# EAGLE design main_pa8 (EAGLE 4.13)
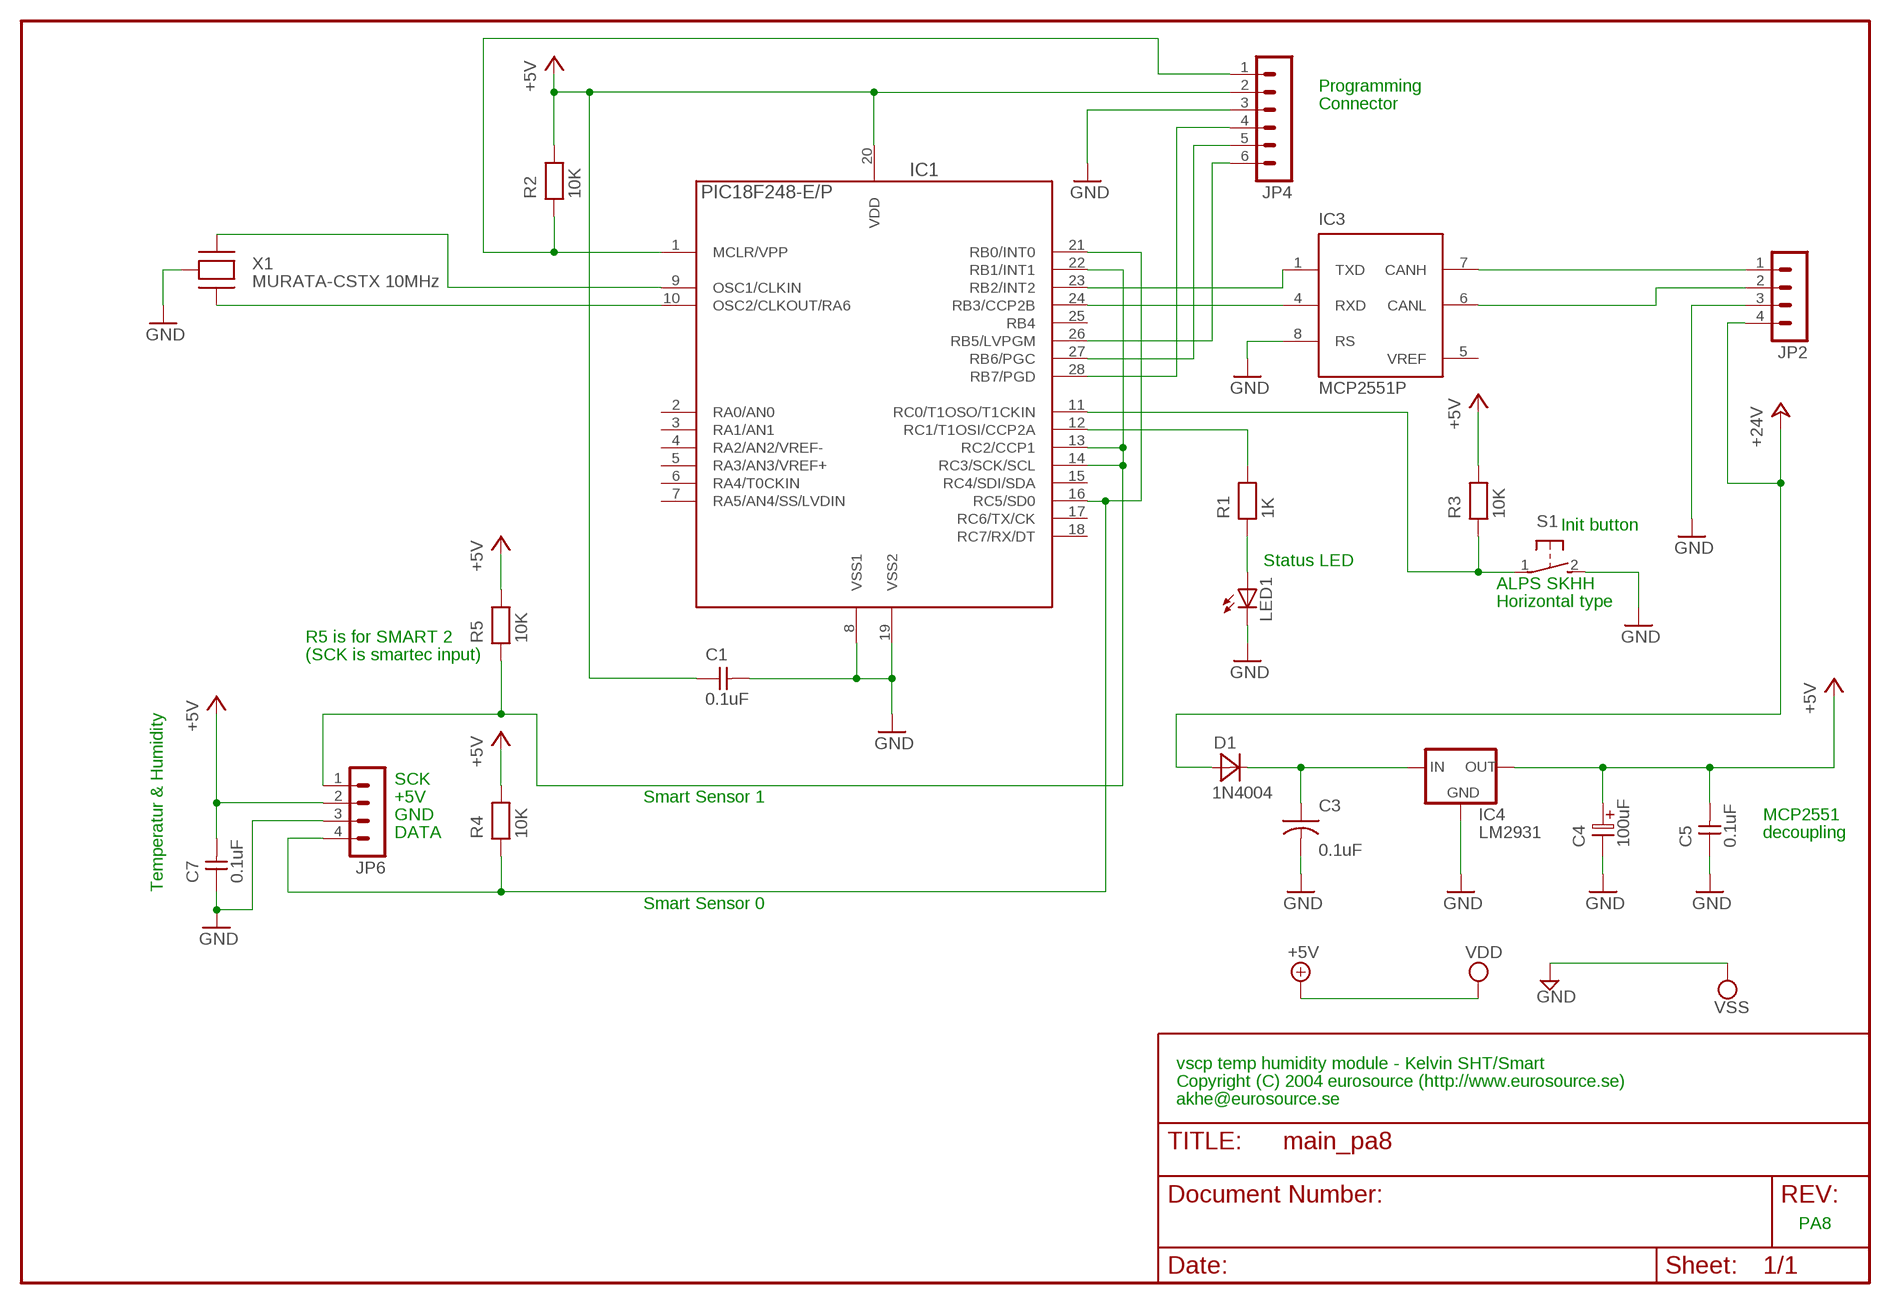
[diagram p0: schematic, sheet 1]

## Parts
C1  0.1uF  CAPNP-2,5  [C-2,5]
C3  0.1uF  CAP-5  [C-5]
C4  100uF  ELC-5  [ES-5]
C5  0.1uF  CAPNP-2,5  [C-2,5]
C7  0.1uF  CAPNP-2,5  [C-2,5]
D1  1N4004  DIODE-10  [D-10]
IC1  PIC18F248-E/P  PIC18F252-E/P  [PDIP-28]
IC3  MCP2551P  [DIL8]
IC4  LM2931  78LXX  [78LXX]
JP2  MA04-1  [MA04-1]
JP4  MA06-1  [MA06-1]
JP6  MA04-1  [MA04-1]
LED1  LED3MM  [LED3MM]
R1  1K  RESEU-10  [R-10]
R2  10K  RESEU-10  [R-10]
R3  10K  RESEU-10  [R-10]
R4  10K  RESEU-10  [R-10]
R5  10K  RESEU-10  [R-10]
S1  31-XX  [B3F-31XX]
X1  MURATA-CSTX 10MHz  MURATA-CSTX  [RESONATOR-MURATA]

## Nets
+5V: C1.1 C4.1 C5.2 C7.2 IC1.20(VDD) IC4.OUT JP4.2 JP6.2 R2.2 R3.2 R4.2 R5.2 ; supply symbol labelled VDD
+24V: D1.1(A) JP2.4
CANH: IC3.7(CANH) JP2.1
CANL: IC3.6(CANL) JP2.2
GND: C1.2 C3.2 C4.2 C5.1 C7.1 IC1.8(VSS1) IC1.19(VSS2) IC3.8(RS) IC4.GND JP2.3 JP4.3 JP6.3 LED1.K(C) S1.2(S) X1.2(GND) ; supply symbol labelled VSS
N$1: LED1.A R1.1
N$2: IC1.12(RC1/T1OSI/CCP2A) R1.2
N$3: IC1.10(OSC2/CLKOUT/RA6) X1.3(XTOUT)
N$4: IC1.1(MCLR/VPP) JP4.1 R2.1
N$5: IC1.28(RB7/PGD) JP4.4
N$6: IC1.11(RC0/T1OSO/T1CKIN) R3.1 S1.1(P)
N$7: IC1.27(RB6/PGC) JP4.5
N$8: IC1.26(RB5/LVPGM) JP4.6
N$11: C3.1 D1.2(K) IC4.IN
OSC1: IC1.9(OSC1/CLKIN) X1.1(XTIN)
RXCAN: IC1.24(RB3/CCP2B) IC3.4(RXD)
SCK: IC1.13(RC2/CCP1) IC1.14(RC3/SCK/SCL) IC1.22(RB1/INT1) JP6.1 R5.1
SDO: IC1.16(RC5/SD0) IC1.21(RB0/INT0) JP6.4 R4.1
TXCAN: IC1.23(RB2/INT2) IC3.1(TXD)
Unconnected: IC1.2(RA0/AN0) IC1.3(RA1/AN1) IC1.4(RA2/AN2/VREF-) IC1.5(RA3/AN3/VREF+) IC1.6(RA4/T0CKIN) IC1.7(RA5/AN4/SS/LVDIN) IC1.15(RC4/SDI/SDA) IC1.17(RC6/TX/CK) IC1.18(RC7/RX/DT) IC1.25(RB4)

## Notes on the sheet
- Programming
- Connector
- Init button
- Status LED
- ALPS SKHH
- Horizontal type
- R5 is for SMART 2
- (SCK is smartec input)
- SCK
- +5V | Smart Sensor 1
- GND | MCP2551
- DATA | decoupling
- Temperatur & Humidity
- Smart Sensor 0
- vscp temp humidity module - Kelvin SHT/Smart
- Copyright (C) 2004 eurosource (http://www.eurosource.se)
- akhe@eurosource.se
- PA8

## Power pins joined to a net without a drawn wire
+5V: IC3.3(VDD)
GND: IC3.2(VSS)
VREF: IC3.5(VREF)

## Library data of the parts
C1 C5 C7 = discrete:CAPNP-2,5
C3 = discrete:CAP-5
C4 = discrete:ELC-5
D1 = discrete:DIODE-10
IC1 = pic18:PIC18*F252-?: 18F252, 28 pin, 32Kb prog, 1536 data, 256 EEPROM
IC3 = microchip_can:MCP2551: High Speed CAN tranceiver
IC4 = v-reg:78LXX: VOLTAGE REGULATOR
JP2 JP6 = con-lstb:MA04-1
JP4 = con-lstb:MA06-1
LED1 = led:LED: LED OSRAM: - CHIPLED LG R971, LG N971, LY N971, LG Q971, LY Q971, LO R971, LY R971 LH N974, LH R974 LS Q976, LO Q976, LY Q976 LO Q996 - Hyper CHIPLED LW Q18S LB Q993, LB Q99A, LB R99A - SideLED LS A670, LO A670, LY A670, LG A670, LP A670 LB A673, LV A673, LT A673, LW A673 LH A674 LY A675 LS A676, LA A676, LO A676, LY A676, LW A676 LS A679, LY A679, LG A679 - Hyper Micro SIDELED® LS Y876, LA Y876, LO Y876, LY Y876 LT Y87S - SmartLED LW L88C, LW L88S LB L89C, LB L89S, LG L890 LS L89K, LO L89K, LY L89K LS L896, LA L896, LO L896, LY L896 - TOPLED LS T670, LO T670, LY T670, LG T670, LP T670 LSG T670, LSP T670, LSY T670, LOP T670, LYG T670 LG T671, LOG T671, LSG T671 LB T673, LV T673, LT T673, LW T673 LH T674 LS T676, LA T676, LO T676, LY T676, LB T676, LH T676, LSB T676, LW T676 LB T67C, LV T67C, LT T67C, LS T67K, LO T67K, LY T67K, LW E67C LS E67B, LA E67B, LO E67B, LY E67B, LB E67C, LV E67C, LT E67C LW T67C LS T679, LY T679, LG T679 LS T770, LO T770, LY T770, LG T770, LP T770 LB T773, LV T773, LT T773, LW T773 LH T774 LS E675, LA E675, LY E675, LS T675 LS T776, LA T776, LO T776, LY T776, LB T776 LHGB T686 LT T68C, LB T68C - Hyper Mini TOPLED® LB M676 - Mini TOPLED Santana® LG M470 LS M47K, LO M47K, LY M47K Source: http://www.osram.convergy.de/
R1-R5 = discrete:RESEU-10
S1 = switch-omron:31-XX: OMRON SWITCH
X1 = eurosource_ftdi:MURATA-CSTX

## Board
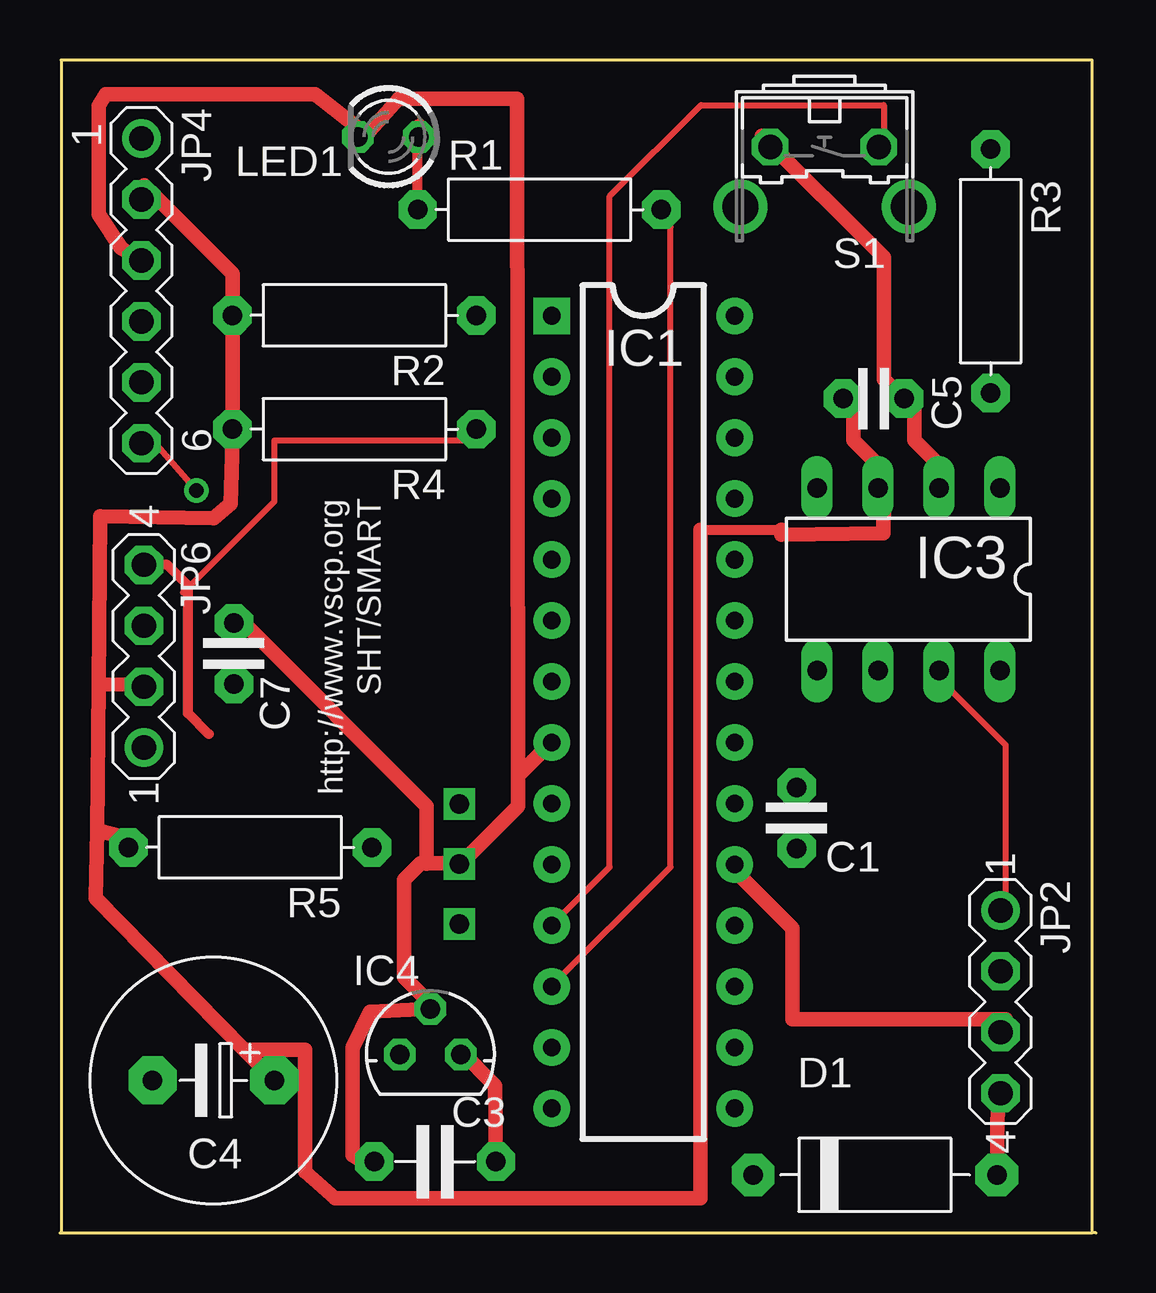
[diagram p1: board, top side]
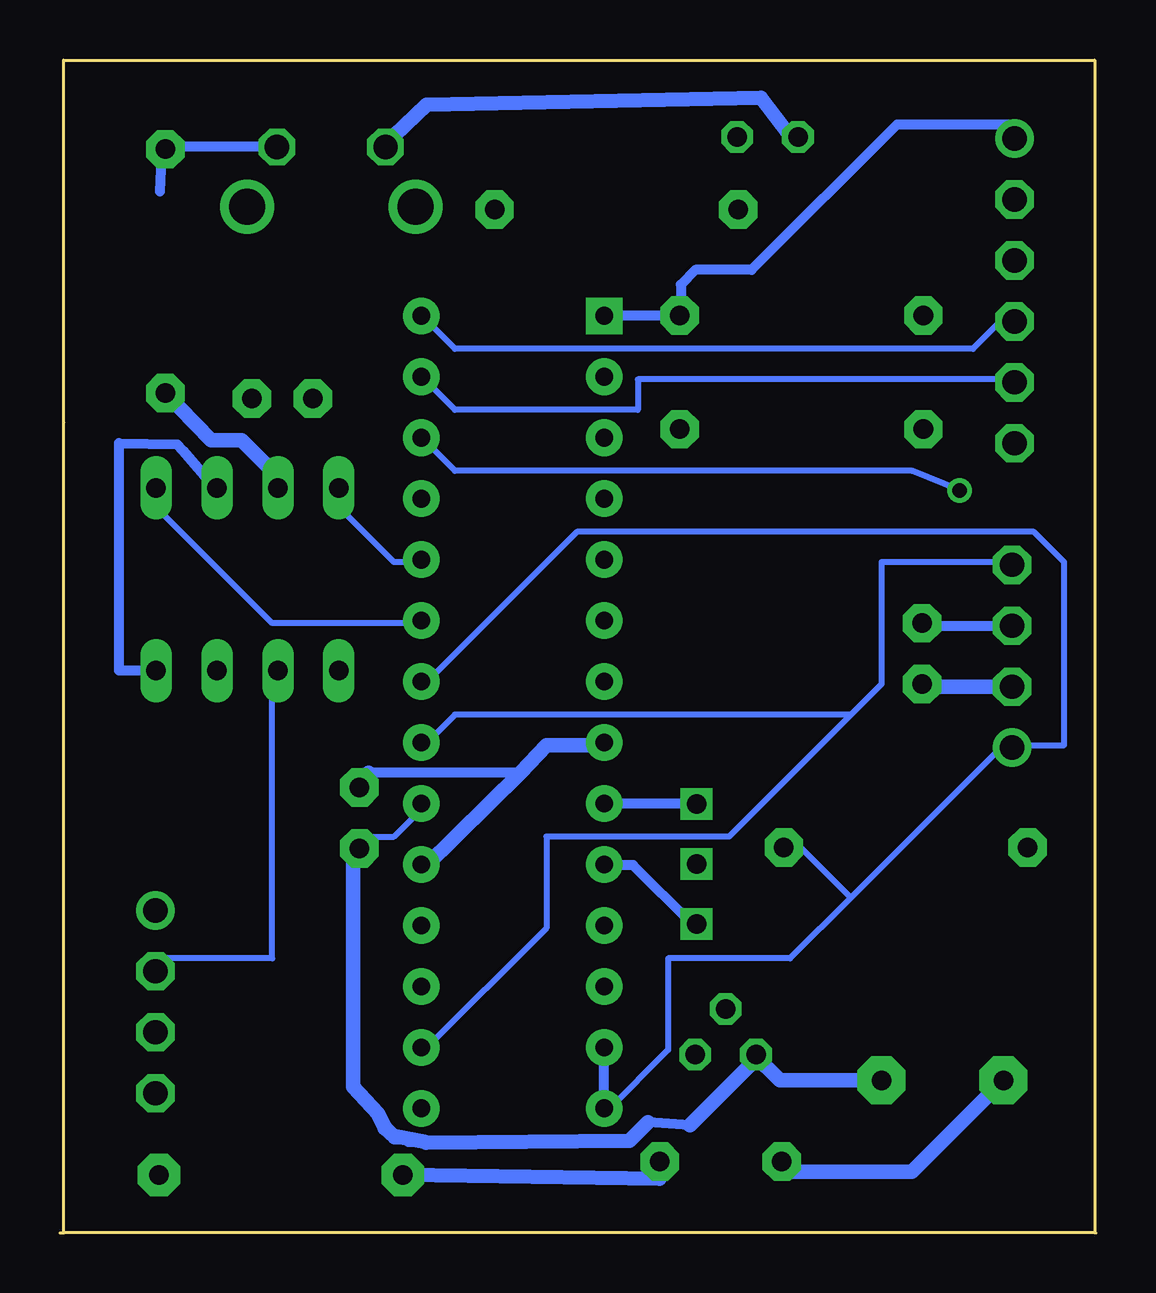
[diagram p2: board, bottom side, seen from below]

Size 43.18 x 48.87 mm. Coordinates in mm from the lower left corner, seen from the top.
Copper layers (1*16): Top 0.035mm / dielectric 1.5mm / Bottom 0.035mm
Design rules "10mils": minimum track width 10mil, minimum drill 24mil, track to track 10mil, track to pad 10mil, pad to pad 10mil, via to via 10mil, smd to smd 10mil, copper to edge 40mil, drill to drill 10mil, minimum pad ring 10mil, minimum via ring 8mil, stop-mask expansion 0mil, vias tented up to drill 0mil, thermal gap 10mil

### Footprints (pad centres in the part's own frame; a part is rotated, then mirrored left to right if it is on the bottom)
C-2,5 = drill 0.813 pad 1.6 octagon: 1 -1.27,0; 2 1.27,0
C-5 = drill 0.813 pad 1.6 octagon: 1 -2.54,0; 2 2.54,0
ES-5 = drill 0.813 pad 2.007 octagon: 1 -2.54,0; 2 2.54,0
D-10 = drill 0.813 pad 1.778 octagon: 1 -5.08,0; 2 5.08,0
PDIP-28 = drill 0.737 pad 1.524 square: 1 -17.78,-3.81 | drill 0.737 pad 1.524 round: 2 -15.24,-3.81; 3 -12.7,-3.81; 4 -10.16,-3.81; 5 -7.62,-3.81; 6 -5.08,-3.81; 7 -2.54,-3.81; 8 0,-3.81; 9 2.54,-3.81; 10 5.08,-3.81; 11 7.62,-3.81; 12 10.16,-3.81; 13 12.7,-3.81; 14 15.24,-3.81; 15 15.24,3.81; 16 12.7,3.81; 17 10.16,3.81; 18 7.62,3.81; 19 5.08,3.81; 20 2.54,3.81; 21 0,3.81; 22 -2.54,3.81; 23 -5.08,3.81; 24 -7.62,3.81; 25 -10.16,3.81; 26 -12.7,3.81; 27 -15.24,3.81; 28 -17.78,3.81
DIL8 = drill 0.813 long: 1 -3.81,-3.81; 2 -1.27,-3.81; 3 1.27,-3.81; 4 3.81,-3.81; 5 3.81,3.81; 6 1.27,3.81; 7 -1.27,3.81; 8 -3.81,3.81
78LXX = drill 0.813 octagon: GND 0,1.905; IN 1.27,0; OUT -1.27,0
MA04-1 = drill 1.016 pad 1.6 round: 1 -3.81,0 | drill 1.016 pad 1.6 octagon: 2 -1.27,0; 3 1.27,0; 4 3.81,0
MA06-1 = drill 1.016 pad 1.6 round: 1 -6.35,0 | drill 1.016 pad 1.6 octagon: 2 -3.81,0; 3 -1.27,0; 4 1.27,0; 5 3.81,0; 6 6.35,0
LED3MM = drill 0.813 octagon: A -1.27,0; K 1.27,0
R-10 = drill 0.813 pad 1.6 octagon: 1 -5.08,0; 2 5.08,0
B3F-31XX = drill 1.016 octagon: 1 -2.261,-1.245; 2 2.261,-1.245 | drill 1.499 pad 2.159 round: 3 -3.505,1.245; 4 3.505,1.245
RESONATOR-MURATA = drill 0.813 square: 1 0,0; 2 2.5,0; 3 5,0

### Placement (x,y rotation side)
C1  30.7,17.29 90 top
C3  15.64,2.96 180 top
C4  6.4,6.35 180 top
C5  33.91,34.76 180 top
C7  7.25,24.13 270 top
D1  33.97,2.41 180 top
IC1  24.31,20.43 270 top
IC3  35.37,27.23 180 top
IC4  15.44,7.43 0 top
JP2  39.2,9.63 270 top
JP4  3.4,39.25 270 top
JP6  3.5,24.02 90 top
LED1  13.69,45.66 180 top
R1  19.99,42.63 0 top
R2  12.27,38.23 180 top
R3  38.79,40.07 270 top
R4  12.27,33.48 180 top
R5  7.93,16.06 180 top
S1  31.87,44 180 top
U$2  [DIN_SIMPLE]  0.05,0 0 top
X1  16.65,17.87 270 top

### Tracks (layer width: path | path; a pad name or v marks a point on that pad's centre or on a via)
+5V
  Top 0.254: IC3.3 34.34,31.75 | 3.86,22.86 JP6.2
  Top 0.406: 3.51,43.65 3.51,43.64 JP4.2 | R4.2 7.19,33.41 7.17,33.38 | 26.7,29.29 30.06,29.29
  Top 0.61: 3.51,43.65 7.19,39.97 R2.2 R4.2 7.2,33.02 7.12,30.38 6.4,29.76 1.68,29.86 1.62,22.83 | 1.55,16.77 1.48,13.94 7.67,7.62 | 1.55,16.77 1.62,22.83 | 7.67,7.62 C4.1 | 34.34,31.75 33.07,33.02 33.07,34.29 C5.2 | 7.67,7.62 10.21,7.62 10.21,2.54 11.46,1.43 26.7,1.43 26.7,29.29 | 30.06,29.29 30.08,29.08 34.32,29.15 34.34,30.48 IC3.3 | 1.62,22.83 3.86,22.86 | 1.55,16.77 2.59,16.51 R5.2
  Bottom 0.254: 27.99,17.78 28.12,17.95 | 27.99,17.78 29.26,16.51 30.53,16.51 C1.1 | 27.99,17.78 IC1.20 | 38.87,35.06 R3.2
  Bottom 0.406: 14.25,7.43 | 14.25,7.43 IC4.OUT | 28.12,17.95 28.13,17.96 | 14.25,7.43 14.25,7.38 14.26,7.38 14.26,7.15 | 16.92,4.49 18.67,4.6 | 27.92,3.75 28.66,3.78 27.99,3.79 | 30.7,16.04 30.68,16.07 | 30.7,16.04 C1.1 | 30.97,15.78 30.7,16.04 | C7.2 7.27,22.86 | C7.2 | 7.15,22.75 C7.2
  Bottom 0.61: C4.1 13.17,6.35 14.25,7.43 | 14.26,7.15 16.92,4.49 | 18.67,4.6 19.44,3.83 27.92,3.75 | 27.99,3.79 29.19,4.03 29.09,3.98 29.24,3.98 | 29.65,4.36 29.24,3.98 | 29.24,3.98 29.7,4.48 29.91,4.96 30.97,6.09 30.97,15.78 | JP6.2 7.15,22.75 | 38.87,35.06 36.88,33.02 35.61,33.02 34.34,31.75 IC3.3
+24V
  Top 0.406: JP2.4 39.2,5.76 39.21,5.75 39.09,5.62
  Top 0.61: D1.1 39.09,5.62
CANH
  Top 0.254: IC3.7 36.88,22.86 39.42,20.32 39.42,13.97 JP2.1
CANL
  Bottom 0.254: IC3.6 34.34,22.86 34.34,11.43 39.42,11.43 JP2.2
GND
  Top 0.254: 35.61,34.29 C5.1 | S1.2 29.26,45.72 | 7.67,25.4 C7.1 | IC1.19 27.99,15.24 | X1.2 16.56,15.24 | 20.37,20.32 IC1.8 | 12.75,45.72 LED1.K | 15.04,15.4 15.29,15.38
  Top 0.406: 13,2.72 13.03,2.71 C3.2 | IC4.GND 15.44,9.54 | X1.2 16.7,15.37 16.67,15.4 | 12.49,45.99 12.47,46.01 LED1.K
  Top 0.61: IC4.GND 12.92,9.21 12.19,7.72 12.19,3.24 13.03,2.71 | 15.44,9.54 14.34,10.64 14.34,14.7 15.04,15.4 16.67,15.4 | JP4.3 2.55,41.02 1.62,42.44 1.62,46.96 1.91,47.43 10.63,47.43 12.47,46.01 | IC3.2 36.88,31.75 35.61,33.02 35.61,34.29 34.34,35.56 34.34,40.64 29.26,45.72 | 27.99,15.24 30.53,12.7 30.53,8.89 39.42,8.89 JP2.3 | 16.56,15.24 19.1,17.78 19.1,19.05 | 19.1,19.05 20.37,20.32 | 12.75,45.72 14.12,47.25 19.05,47.25 19.1,19.05 | 7.67,25.4 15.29,17.78 15.29,15.38
  Bottom 0.254: 27.99,15.24 IC1.19 | IC1.8 20.37,20.32 | 12.75,2.54 C3.2 | LED1.K 12.75,45.72
  Bottom 0.406: C7.1 7.46,25.4 7.35,25.29 JP6.3 | 23.97,19.18 30.32,19.18 | IC3.8 40.72,23.42 40.72,32.91 38.3,32.85 38.06,32.6 36.67,30.97 IC3.2
  Bottom 0.61: 27.99,15.24 23.97,19.18 22.91,20.32 20.37,20.32 | 30.32,19.18 C1.2 | C4.2 7.67,2.54 12.75,2.54 | 12.75,45.72 13.97,47.3 27.91,47.01 29.26,45.72 S1.2
N$1
  Top 0.406: LED1.A 15.01,46.22 14.99,46.24 14.91,46.16 R1.1
N$2
  Top 0.254: IC1.12 20.37,10.16 25.45,15.24 25.45,41.91 R1.2
N$3
  Bottom 0.406: X1.3 16.84,12.87 19.29,15.32 20.44,15.32 20.5,15.38 | 20.5,15.38 20.54,15.41 | 20.5,15.38 IC1.10
N$4
  Bottom 0.406: 20.5,38.28 20.54,38.32 | 20.5,38.28 IC1.1 17.42,38.21 17.3,38.32 17.3,39.51 16.69,40.12 14.35,40.12 8.29,46.18 3.45,46.18 3.42,46.15 3.47,46.1 JP4.1 | R2.1 20.45,38.23 20.5,38.28
N$5
  Bottom 0.254: IC1.28 27.99,38.1 26.72,36.83 5.13,36.83 3.86,38.1 JP4.4
N$6
  Top 0.254: IC1.11 20.37,12.7 22.91,15.24 22.91,43.18 26.72,46.99 34.34,46.99 34.34,45.72 S1.1
  Bottom 0.406: 38.95,45.24 38.85,45.15 R3.1 | S1.1 38.95,45.24 | 38.95,45.24 39.02,43.38
N$7
  Bottom 0.254: IC1.27 27.99,35.56 26.72,34.29 19.1,34.29 19.1,35.56 3.86,35.56 JP4.5
N$8  (via drill 0.61)
  Top 0.254: v5.68,30.94 3.86,33.02 JP4.6
  Bottom 0.254: v5.68,30.94 7.67,31.75 26.72,31.75 27.99,33.02 IC1.26
N$11
  Top 0.406: 16.61,7.67 16.71,7.57 IC4.IN
  Top 0.61: C3.1 18.14,6.13 16.71,7.57
  Bottom 0.406: 18.14,2.3 18.05,2.4 | 18.14,2.3 C3.1 | 18.14,2.3 18.19,2.25
  Bottom 0.61: 18.19,2.25 D1.2
OSC1
  Bottom 0.406: 20.54,17.89 20.54,17.9 | 20.54,17.89 IC1.9 | X1.1 20.54,17.87 20.54,17.89
RXCAN
  Bottom 0.254: IC3.4 31.8,30.48 29.26,27.94 27.99,27.94 IC1.24
SCK
  Bottom 0.254: 3.86,20.32 10.21,13.97 | 10.21,13.97 12.75,11.43 17.83,11.43 17.83,7.62 20.37,5.08 IC1.14 | 10.21,13.97 12.75,16.51 R5.1 | 3.86,20.32 1.32,20.32 1.32,27.94 2.59,29.21 21.64,29.21 27.99,22.86 IC1.22 | JP6.1 3.86,20.32
  Bottom 0.406: 20.51,7.83 20.51,7.73 | 20.51,7.73 IC1.13 | IC1.14 20.51,5.19 20.51,7.73
SDO
  Top 0.254: R4.1 17.83,33.02 8.94,33.02 8.94,30.48 5.13,26.67 5.34,26.67
  Top 0.406: JP6.4 4.48,27.83 5.34,26.97 5.34,26.67 5.34,21.65 6.21,20.78
  Bottom 0.254: 10.21,21.59 8.94,22.86 8.94,27.94 3.86,27.94 JP6.4 | 10.21,21.59 15.29,16.51 22.91,16.51 22.91,12.7 27.99,7.62 IC1.16 | 10.21,21.59 26.72,21.59 27.99,20.32 IC1.21
TXCAN
  Bottom 0.254: IC3.1 39.42,30.48 34.34,25.4 27.99,25.4 IC1.23

### Text on the board
tNames: http://www.vscp.org | SHT/SMART
tValues: eurosource